# EAGLE design circuito v4 (EAGLE 9.4.2)

## Sheet 1 of 2
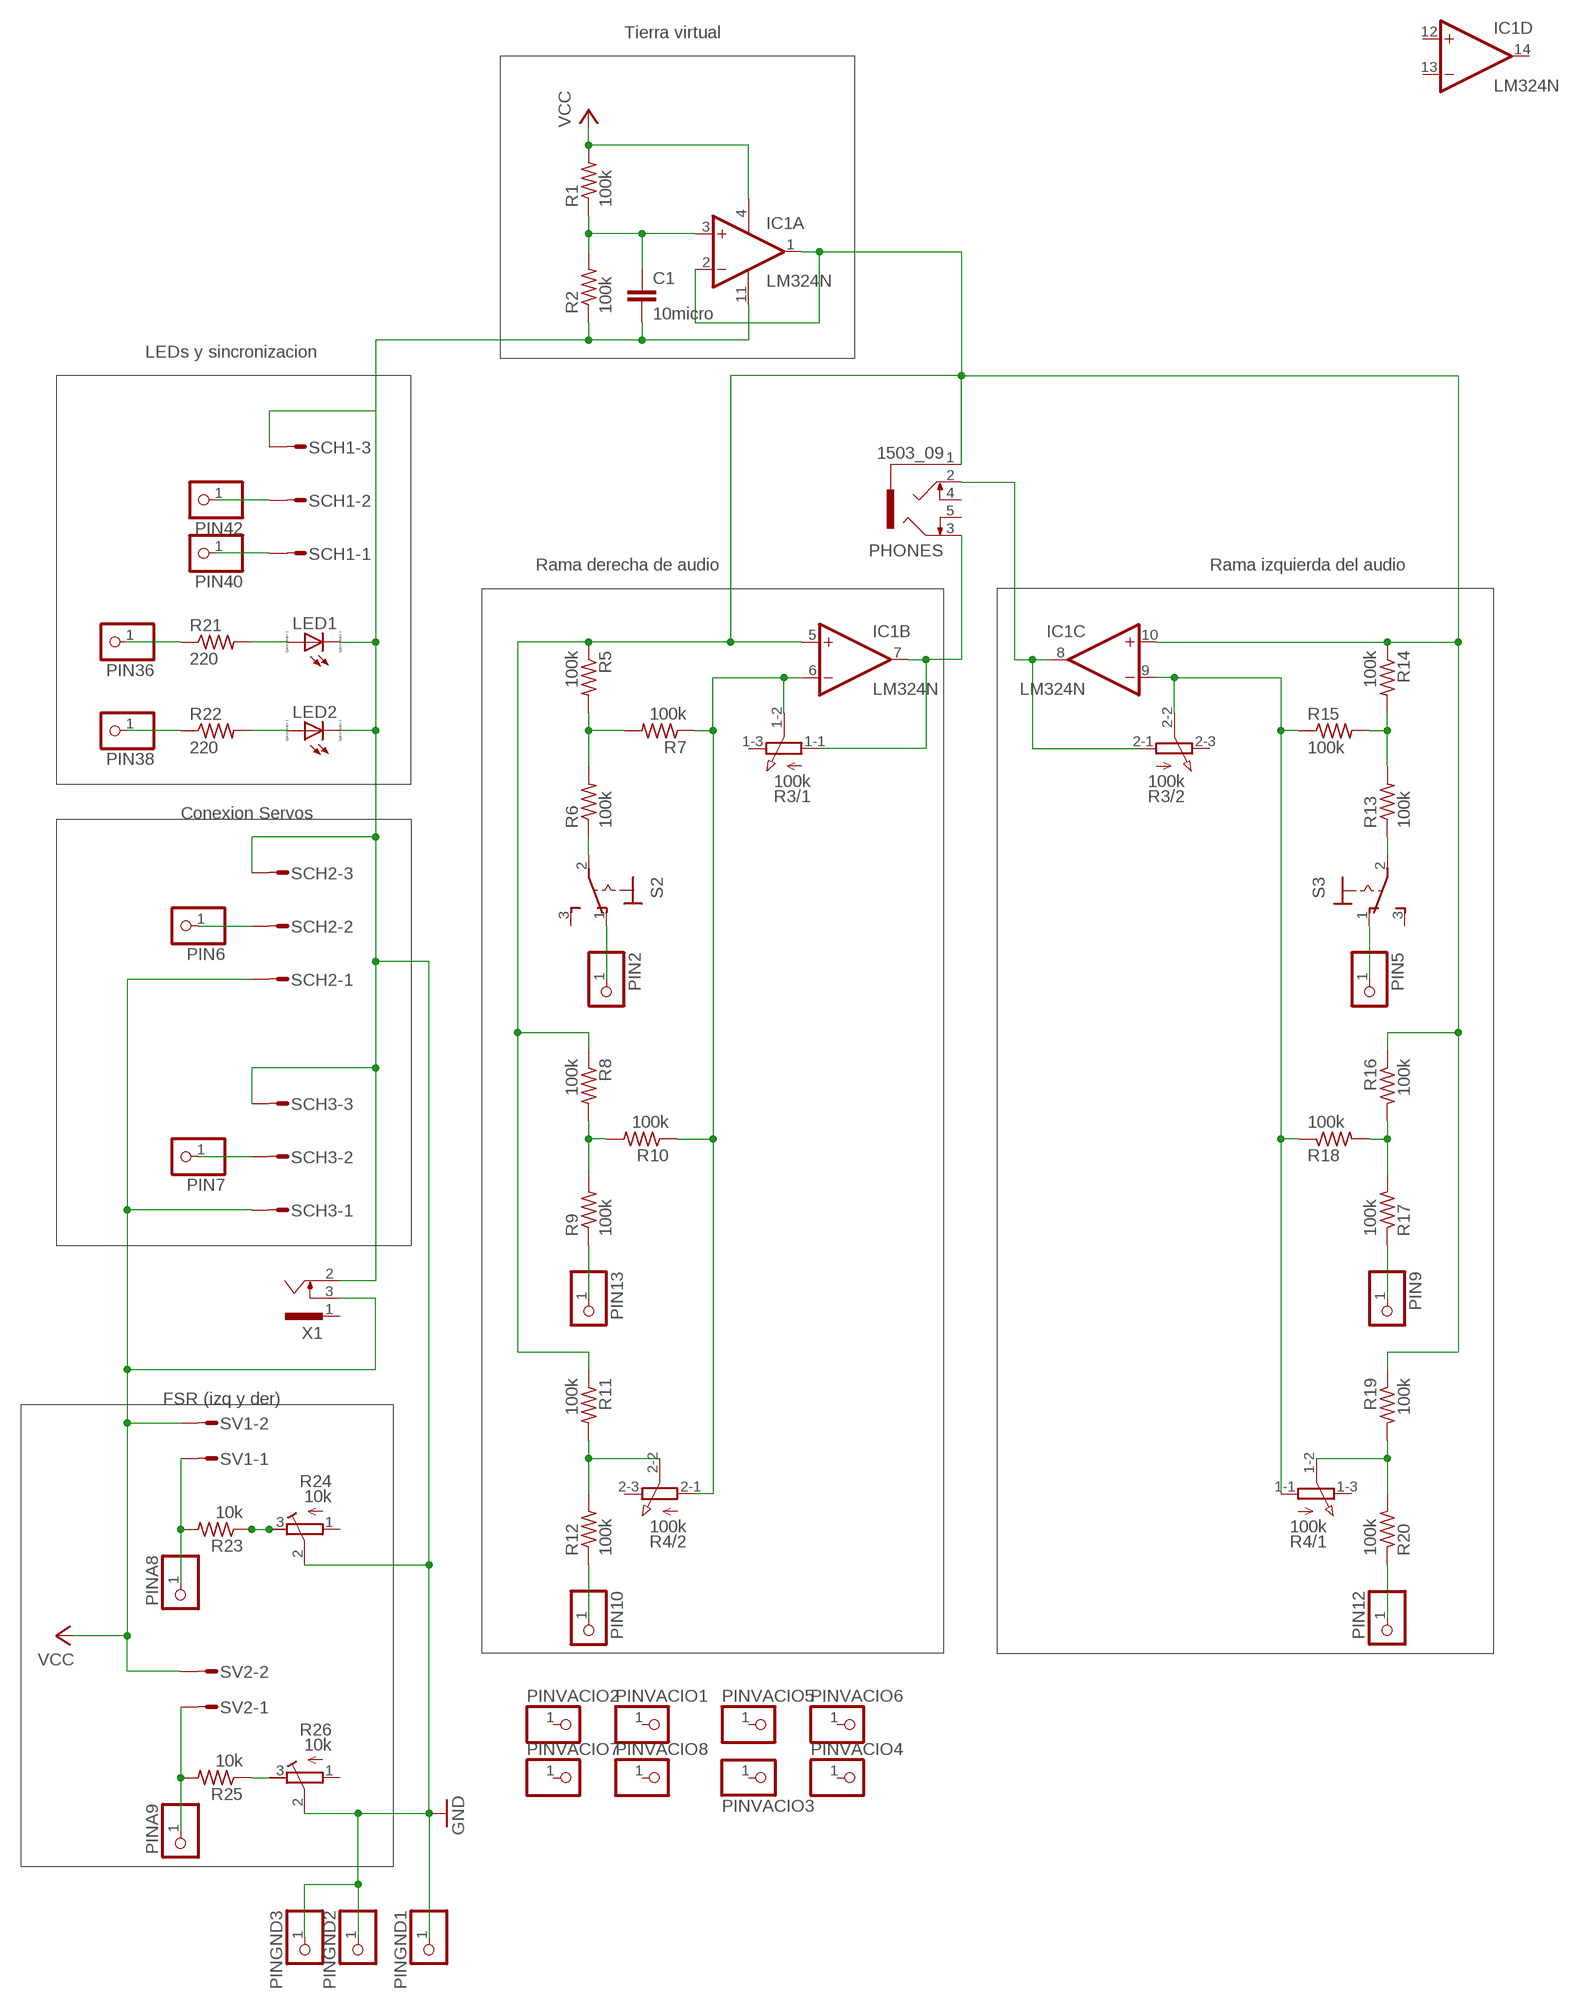
[diagram p0: schematic, sheet 1]

### Parts
C1  10micro  C-EU025-030X050  [C025-030X050]
IC1  LM324N  [DIL14]
LED1  LED_ELD260  [LED_LD260]
LED2  LED_ELD260  [LED_LD260]
PHONES  1503_09  [1503_09]
PIN2  PINHD-1X1  [1X01]
PIN5  PINHD-1X1  [1X01]
PIN6  PINHD-1X1  [1X01]
PIN7  PINHD-1X1  [1X01]
PIN9  PINHD-1X1  [1X01]
PIN10  PINHD-1X1  [1X01]
PIN12  PINHD-1X1  [1X01]
PIN13  PINHD-1X1  [1X01]
PIN36  PINHD-1X1  [1X01]
PIN38  PINHD-1X1  [1X01]
PIN40  PINHD-1X1  [1X01]
PIN42  PINHD-1X1  [1X01]
PINA8  PINHD-1X1  [1X01]
PINA9  PINHD-1X1  [1X01]
PINGND1  PINHD-1X1  [1X01]
PINGND2  PINHD-1X1  [1X01]
PINGND3  PINHD-1X1  [1X01]
PINVACIO1  PINHD-1X1  [1X01]
PINVACIO2  PINHD-1X1  [1X01]
PINVACIO3  PINHD-1X1  [1X01]
PINVACIO4  PINHD-1X1  [1X01]
PINVACIO5  PINHD-1X1  [1X01]
PINVACIO6  PINHD-1X1  [1X01]
PINVACIO7  PINHD-1X1  [1X01]
PINVACIO8  PINHD-1X1  [1X01]
R1  100k  R-US_0207/7  [0207/7]
R2  100k  R-US_0207/7  [0207/7]
R3  100k  3RP/1610G  [3RP/1610G]
R4  100k  3RP/1610G  [3RP/1610G]
R5  100k  R-US_0207/7  [0207/7]
R6  100k  R-US_0207/7  [0207/7]
R7  100k  R-US_0207/7  [0207/7]
R8  100k  R-US_0207/7  [0207/7]
R9  100k  R-US_0207/7  [0207/7]
R10  100k  R-US_0207/7  [0207/7]
R11  100k  R-US_0207/7  [0207/7]
R12  100k  R-US_0207/7  [0207/7]
R13  100k  R-US_0207/7  [0207/7]
R14  100k  R-US_0207/7  [0207/7]
R15  100k  R-US_0207/7  [0207/7]
R16  100k  R-US_0207/7  [0207/7]
R17  100k  R-US_0207/7  [0207/7]
R18  100k  R-US_0207/7  [0207/7]
R19  100k  R-US_0207/7  [0207/7]
R20  100k  R-US_0207/7  [0207/7]
R21  220  R-US_0207/7  [0207/7]
R22  220  R-US_0207/7  [0207/7]
R23  10k  R-US_0207/7  [0207/7]
R24  10k  R-TRIMM64W  [RTRIM64W]
R25  10k  R-US_0207/7  [0207/7]
R26  10k  R-TRIMM64W  [RTRIM64W]
S2  320-916  [320-916]
S3  320-916  [320-916]
SCH1  L03P  [L03P]
SCH2  L03P  [L03P]
SCH3  L03P  [L03P]
SV1  L02P  [L02P]
SV2  L02P  [L02P]
X1  SCD-014A  [SCD-014-A]

### Nets
GND: C1.2 IC1.11(P:V-) LED1.K(C) LED2.K(C) PINGND1.1 PINGND2.1 PINGND3.1 R2.1 R24.2(S) R26.2(S) SCH1.3 SCH2.3 SCH3.3 X1.2
N$1: C1.1 IC1.3(A:+IN) R1.1 R2.2
N$2: R25.1 R26.3(E)
N$3: PIN13.1 R9.1
N$4: IC1.6(B:-IN) R3.1-2(/1:S) R4.2-1(/2:A) R7.1 R10.1
N$5: R5.2 R6.2 R7.2
N$6: R6.1 S2.2(P)
N$7: PIN2.1 S2.1(O)
N$8: IC1.1(A:OUT) IC1.2(A:-IN) IC1.5(B:+IN) IC1.10(C:+IN) PHONES.1 R5.1 R8.1 R11.1 R14.1 R16.1 R19.1
N$9: R8.2 R9.2 R10.2
N$11: R4.2-2(/2:S) R11.2 R12.2
N$12: PIN10.1 R12.1
N$13: IC1.9(C:-IN) R3.2-2(/2:S) R4.1-1(/1:A) R15.1 R18.1
N$14: R13.2 R14.2 R15.2
N$15: R13.1 S3.2(P)
N$16: PIN5.1 S3.1(O)
N$18: R4.1-2(/1:S) R19.2 R20.2
N$19: R16.2 R17.2 R18.2
N$20: PIN9.1 R17.1
N$21: PIN12.1 R20.1
N$22: PIN42.1 SCH1.2
N$23: PIN40.1 SCH1.1
N$24: LED1.A R21.2
N$25: PIN36.1 R21.1
N$26: LED2.A R22.2
N$27: PIN38.1 R22.1
N$28: PIN7.1 SCH3.2
N$29: PIN6.1 SCH2.2
N$30: IC1.8(C:OUT) PHONES.2 R3.2-1(/2:A)
N$31: PINA8.1 R23.2 SV1.1
N$32: R23.1 R24.3(E)
N$34: PINA9.1 R25.2 SV2.1
N$37: IC1.7(B:OUT) PHONES.3 R3.1-1(/1:A)
VCC: IC1.4(P:V+) R1.2 SCH2.1 SCH3.1 SV1.2 SV2.2 X1.3
Unconnected: IC1.12(D:+IN) IC1.13(D:-IN) IC1.14(D:OUT) PHONES.4 PHONES.5 PINVACIO1.1 PINVACIO2.1 PINVACIO3.1 PINVACIO4.1 PINVACIO5.1 PINVACIO6.1 PINVACIO7.1 PINVACIO8.1 R3.1-3(/1:E) R3.2-3(/2:E) R4.1-3(/1:E) R4.2-3(/2:E) R24.1(A) R26.1(A) S2.3(S) S3.3(S) X1.1

### Notes on the sheet
- Tierra virtual
- LEDs y sincronizacion
- Rama derecha de audio | Rama izquierda del audio
- Conexion Servos
- FSR (izq y der)

## Sheet 2 of 2
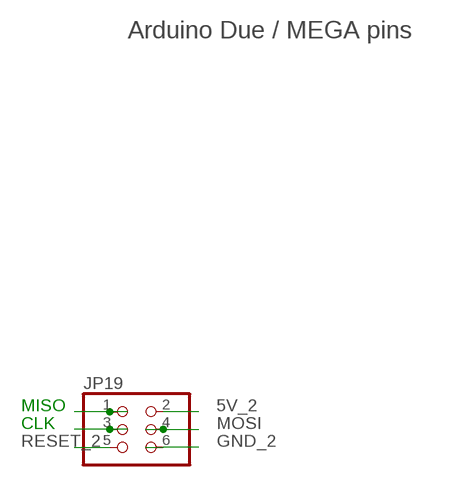
[diagram p1: schematic, sheet 2]

### Parts
JP19  PINHD-2X3  [2X03]

### Nets
5V_2: JP19.2
CLK: JP19.3
MISO: JP19.1
MOSI: JP19.4
RESET_2: JP19.5
Unconnected: JP19.6

### Notes on the sheet
- Arduino Due / MEGA pins

## Library data of the parts
C1 = rcl:C-EU: CAPACITOR, European symbol; SPICEPREFIX: C
IC1 = linear:LM324: OP AMP
JP19 = pinhead:PINHD-2X3: PIN HEADER
LED1 LED2 = eagle-ltspice:LED_E: LED Source: http://www.osram.convergy.de Source: www.luxeon.com Source: www.kingbright.com; SPICEMODEL: NONE; SPICEPREFIX: D; SPICETYPE: diode
PHONES = con-lumberg:1503_09: Jack connectors according to JISC 6560, 3.5 mm Klinkeneinbaukupplung nach JISC 6560, 3,5 mm, 3-polig/ stereo, abgewinkelte Ausführung, mit 2 Öffnern und Lötaugen, für Leiterplatten Rückseitenmontage Source: http://www.lumberg.com/Produkte/PDFs/1503_09.pdf; OC_FARNELL: 1243244; OC_NEWARK: unknown
PIN2 PIN5-PIN7 PIN9 PIN10 PIN12 PIN13 PIN36 PIN38 PIN40 PIN42 PINA8 PINA9 PINGND1-PINGND3 PINVACIO1-PINVACIO8 = pinhead:PINHD-1X1: PIN HEADER
R1 R2 R5-R23 R25 = rcl:R-US_: RESISTOR, American symbol; SPICEPREFIX: R
R3 R4 = pot:3RP/1610G: 16mm Potentiometer two level Source: http://www.alphapotentiometers.net/html/16mm_pot_2.html
R24 R26 = rcl:R-TRIMM: Trimm resistor; SPICEMODEL: X; SPICEPREFIXL: POT
S2 S3 = switch:320-916: TOGGLE SWITCH distributor RS Components
SCH1-SCH3 = con-amp-mt:L03P: AMP MT CONNECTOR; OC_FARNELL: unknown; OC_NEWARK: unknown
SV1 SV2 = con-amp-mt:L02P: AMP MT CONNECTOR; OC_FARNELL: unknown; OC_NEWARK: unknown
X1 = con-shiua-chyuan:SCD-014A: Power Jack 2.5mm; OC_FARNELL: unknown; OC_NEWARK: unknown

## Net classes
1 vcc: width 0.305 mm

## Board
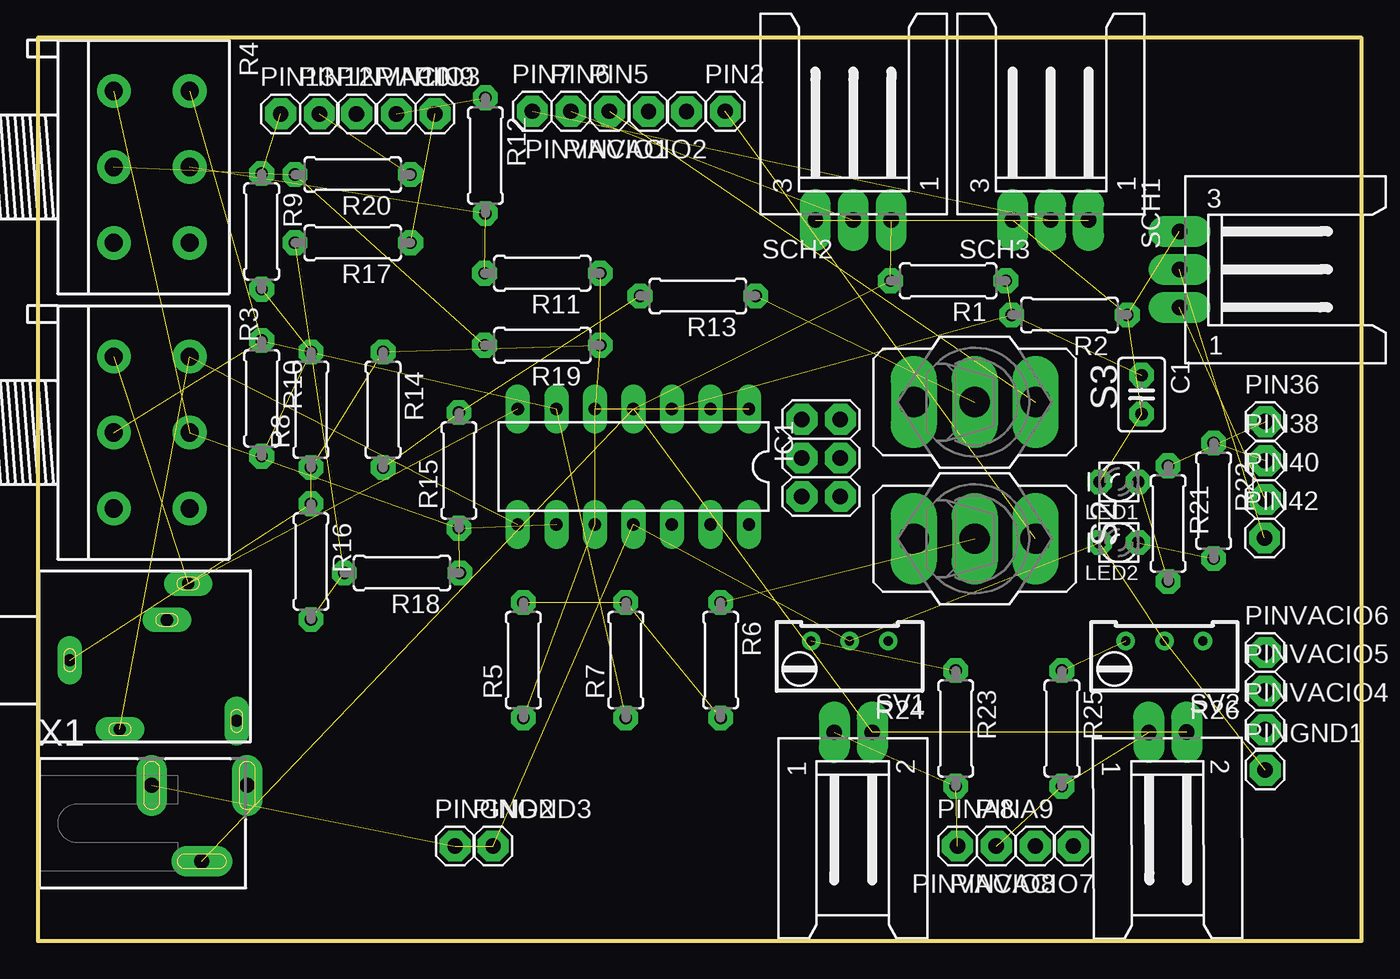
[diagram p2: board, top side]
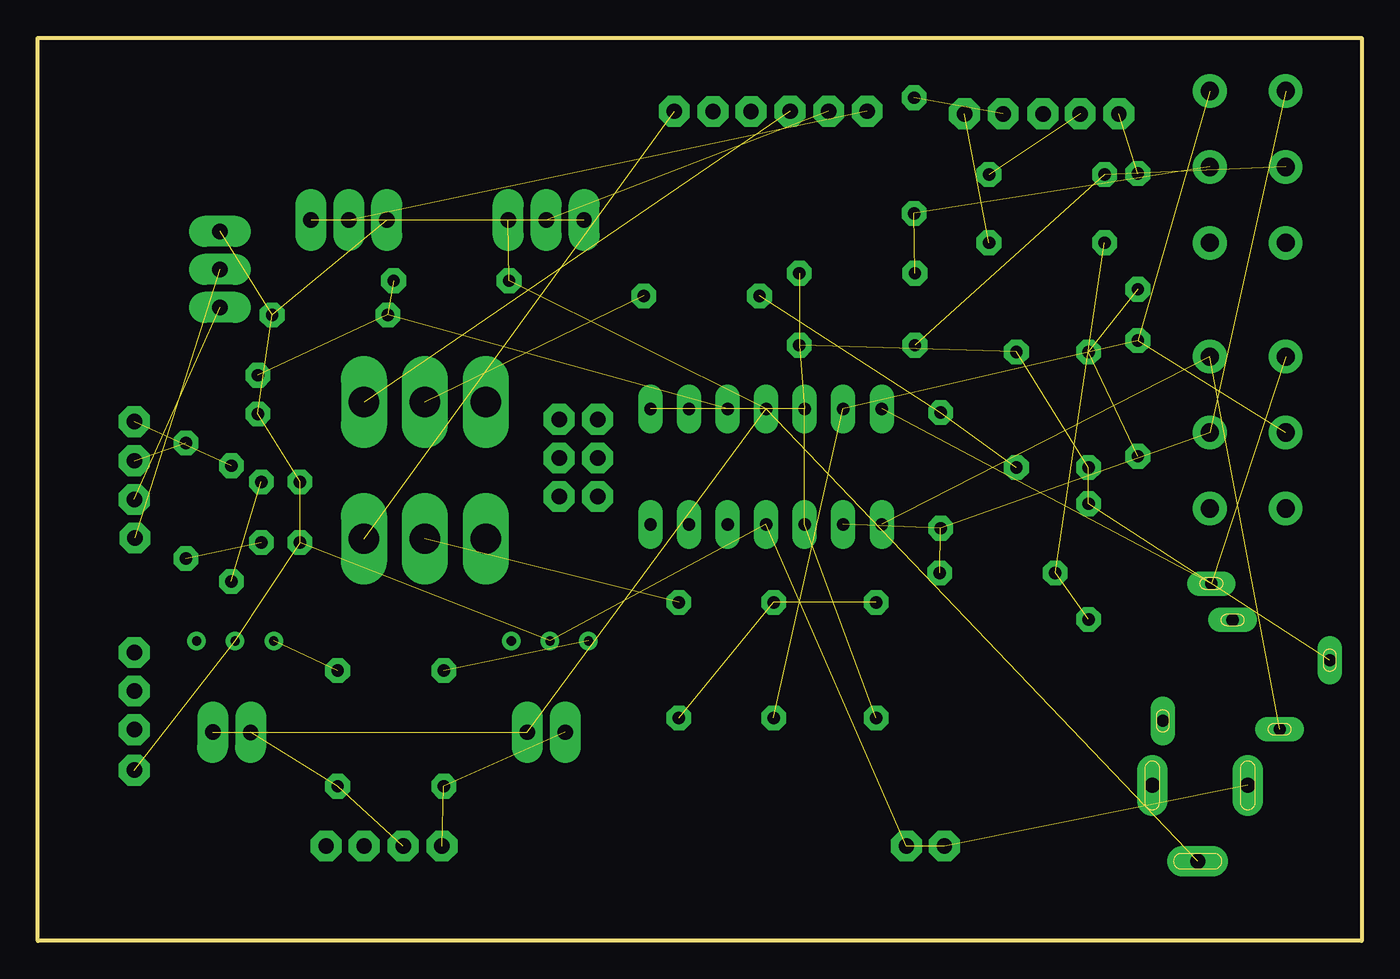
[diagram p3: board, bottom side, seen from below]

Size 87.25 x 59.5 mm. Coordinates in mm from the lower left corner, seen from the top.
Outline: 0,0 87.25,0 87.25,59.5 0,59.5 0,0
Copper layers (1*16): Top 0.035mm / dielectric 1.5mm / Bottom 0.035mm
Design rules "default *": minimum track width 40mil, minimum drill 24mil, track to track 15mil, track to pad 15mil, pad to pad 15mil, via to via 15mil, smd to smd 8mil, copper to edge 40mil, drill to drill 8mil, minimum pad ring 10mil, minimum via ring 20mil, stop-mask expansion 4mil, vias tented up to drill 0mil, thermal gap 10mil
tRestrict: area 50,18.8 to 52,20.8; area 52.5,18.8 to 54.5,20.8; area 55,18.8 to 57,20.8; area 70.8,18.8 to 72.8,20.8; area 73.2,18.8 to 75.2,20.8; area 75.8,18.8 to 77.8,20.8; area 28.2,19.2 to 28.2,22.8; area 30.2,33 to 48.2,37.5; area 30.2,25.2 to 48.2,29.5; area 3.2,54.5 to 6.5,57.5; area 8.5,54.5 to 11.5,57.5; area 3.2,49.5 to 6.5,52.5; 19 more areas
bRestrict: area 25.2,4.5 to 32.2,8; area 58.8,4.2 to 70,8; area 78.8,9.5 to 83,20.8; area 78.8,24.8 to 83,36; area 14,52.8 to 28,56.5; area 30.8,52.8 to 47.2,56.5; area 48.8,27.5 to 54.5,36
vRestrict: area 47.5,48 to 73,59.2; area 77.2,38 to 87,50.5; area 48.8,0.2 to 58.5,11.8; area 69.5,0.2 to 79.5,11.8; area 48.5,16.2 to 58.5,21.2; area 69.2,16.2 to 79.2,21.2; area 0,3.5 to 13.8,59.2; area 30.2,29.5 to 48.2,33; area 55.8,30 to 67.8,32.2

### Footprints (pad centres in the part's own frame; a part is rotated, then mirrored left to right if it is on the bottom)
C025-030X050 = drill 0.813 octagon: 1 -1.27,0; 2 1.27,0
DIL14 = drill 0.813 long: 1 -7.62,-3.81; 2 -5.08,-3.81; 3 -2.54,-3.81; 4 0,-3.81; 5 2.54,-3.81; 6 5.08,-3.81; 7 7.62,-3.81; 8 7.62,3.81; 9 5.08,3.81; 10 2.54,3.81; 11 0,3.81; 12 -2.54,3.81; 13 -5.08,3.81; 14 -7.62,3.81
2X03 = drill 1.016 octagon: 1 -2.54,-1.27; 2 -2.54,1.27; 3 0,-1.27; 4 0,1.27; 5 2.54,-1.27; 6 2.54,1.27
LED_LD260 = drill 0.813 octagon: A -1.27,0; K 1.27,0
1503_09 = drill 0.8 pad 1.2 long: 1 0,-2.1; 2 -4.55,-5.4; 3 5.05,-9.9; 4 -4,-13.1; 5 2.65,-8.5
1X01 = drill 1.016 octagon: 1 0,0
0207/7 = drill 0.813 octagon: 1 -3.81,0; 2 3.81,0
3RP/1610G = drill 1.2 pad 2.184: 1-1 -5,0; 1-2 0,0; 1-3 5,0; 2-1 -5,5; 2-2 0,5; 2-3 5,5
RTRIM64W = drill 0.61: 1 1.27,-2.54; 2 1.27,0; 3 1.27,2.54
320-916 = drill 2.007 long: 1 0,4.013; 2 0,0; 3 0,-4.013
L03P = drill 1.016 long: 1 2.5,-6.25; 2 0,-6.25; 3 -2.5,-6.25
L02P = drill 1.016 long: 1 1.25,-6.25; 2 -1.25,-6.25
SCD-014-A = drill 1 pad 2 long: 1 -2.5,13.8; 2 -2.5,7.5; 3 2.5,10.8

### Placement (x,y rotation side)
C1  72.75,36 270 top
IC1  39.25,31.25 180 top
JP19  51.63,31.83 90 top
LED1  71.25,30.25 180 top
LED2  71.25,26.25 180 top
PHONES  0,18.5 90 top
PIN2  45.3,54.67 0 top
PIN5  37.67,54.67 0 top
PIN6  35.13,54.67 0 top
PIN7  32.59,54.67 0 top
PIN9  26.17,54.5 0 top
PIN10  23.63,54.5 0 top
PIN12  18.55,54.5 0 top
PIN13  16,54.5 0 top
PIN36  80.9,34.22 0 top
PIN38  80.9,31.64 0 top
PIN40  80.9,29.09 0 top
PIN42  80.85,26.55 0 top
PINA8  60.62,6.25 0 top
PINA9  63.17,6.25 0 top
PINGND1  80.9,11.25 0 top
PINGND2  27.5,6.25 0 top
PINGND3  30,6.25 0 top
PINVACIO1  40.25,54.65 180 top
PINVACIO2  42.75,54.65 180 top
PINVACIO3  21,54.5 0 top
PINVACIO4  80.9,13.92 0 top
PINVACIO5  80.9,16.47 0 top
PINVACIO6  80.9,19 0 top
PINVACIO7  68.25,6.25 180 top
PINVACIO8  65.75,6.25 180 top
R1  60,43.5 180 top
R2  68,41.25 180 top
R3  5,33.5 270 top
R4  5,51 270 top
R5  32,18.5 90 top
R6  45,18.5 270 top
R7  38.75,18.5 90 top
R8  18,35 90 top
R9  14.75,46.75 270 top
R10  14.75,35.75 270 top
R11  33.25,44 180 top
R12  29.5,51.75 270 top
R13  43.5,42.5 180 top
R14  22.75,35 270 top
R15  27.75,31 90 top
R16  18,25 270 top
R17  20.75,46 180 top
R18  24,24.25 180 top
R19  33.25,39.25 180 top
R20  20.75,50.5 180 top
R21  74.5,27.5 270 top
R22  77.5,29 270 top
R23  60.5,14 270 top
R24  53.5,18.5 90 top
R25  67.5,14 270 top
R26  74.25,18.5 90 top
S2  61.75,26.5 270 top
S3  61.75,35.5 270 top
SCH1  81.5,44.25 270 top
SCH2  53.75,53.75 0 top
SCH3  66.75,53.75 0 top
SV1  53.75,7.5 180 top
SV2  74.5,7.5 180.2 top
X1  0,7.75 270 top

### Tracks (layer width: path | path; a pad name or v marks a point on that pad's centre or on a via)
GND  (13 unrouted)
N$1  (3 unrouted)
N$2  (1 unrouted)
N$3  (1 unrouted)
N$4  (4 unrouted)
N$5  (2 unrouted)
N$6  (1 unrouted)
N$7  (1 unrouted)
N$8  (10 unrouted)
N$9  (2 unrouted)
N$10
  pour Bottom: -11.65,-53.4 -11.65,-53.25 -11.64,-53.25
N$11  (2 unrouted)
N$12  (1 unrouted)
N$13  (4 unrouted)
N$14  (2 unrouted)
N$15  (1 unrouted)
N$16  (1 unrouted)
N$18  (2 unrouted)
N$19  (2 unrouted)
N$20  (1 unrouted)
N$21  (1 unrouted)
N$22  (1 unrouted)
N$23  (1 unrouted)
N$24  (1 unrouted)
N$25  (1 unrouted)
N$26  (1 unrouted)
N$27  (1 unrouted)
N$28  (1 unrouted)
N$29  (1 unrouted)
N$30  (2 unrouted)
N$31  (2 unrouted)
N$32  (1 unrouted)
N$34  (2 unrouted)
N$37  (2 unrouted)
VCC  (6 unrouted)